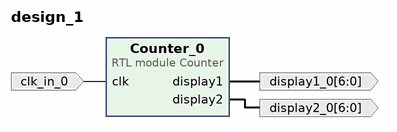
[diagram p0: block diagram of the top level]
# Vivado block design design_1, xc7z020clg400-1, Vivado 2023.1
create_bd_design design_1

create_bd_port -dir I clk_in_0
create_bd_port -dir O -from 6 -to 0 display1_0
create_bd_port -dir O -from 6 -to 0 display2_0

create_bd_cell -type module -reference Counter Counter_0

# ---- connections ----

connect_bd_net [get_bd_pins Counter_0/display1] [get_bd_ports display1_0]
connect_bd_net [get_bd_pins Counter_0/display2] [get_bd_ports display2_0]
connect_bd_net -net clk_in_0_1 [get_bd_ports clk_in_0] [get_bd_pins Counter_0/clk]

validate_bd_design
save_bd_design
